# EAGLE design bat-phone Dodo (EAGLE 9.1.0)
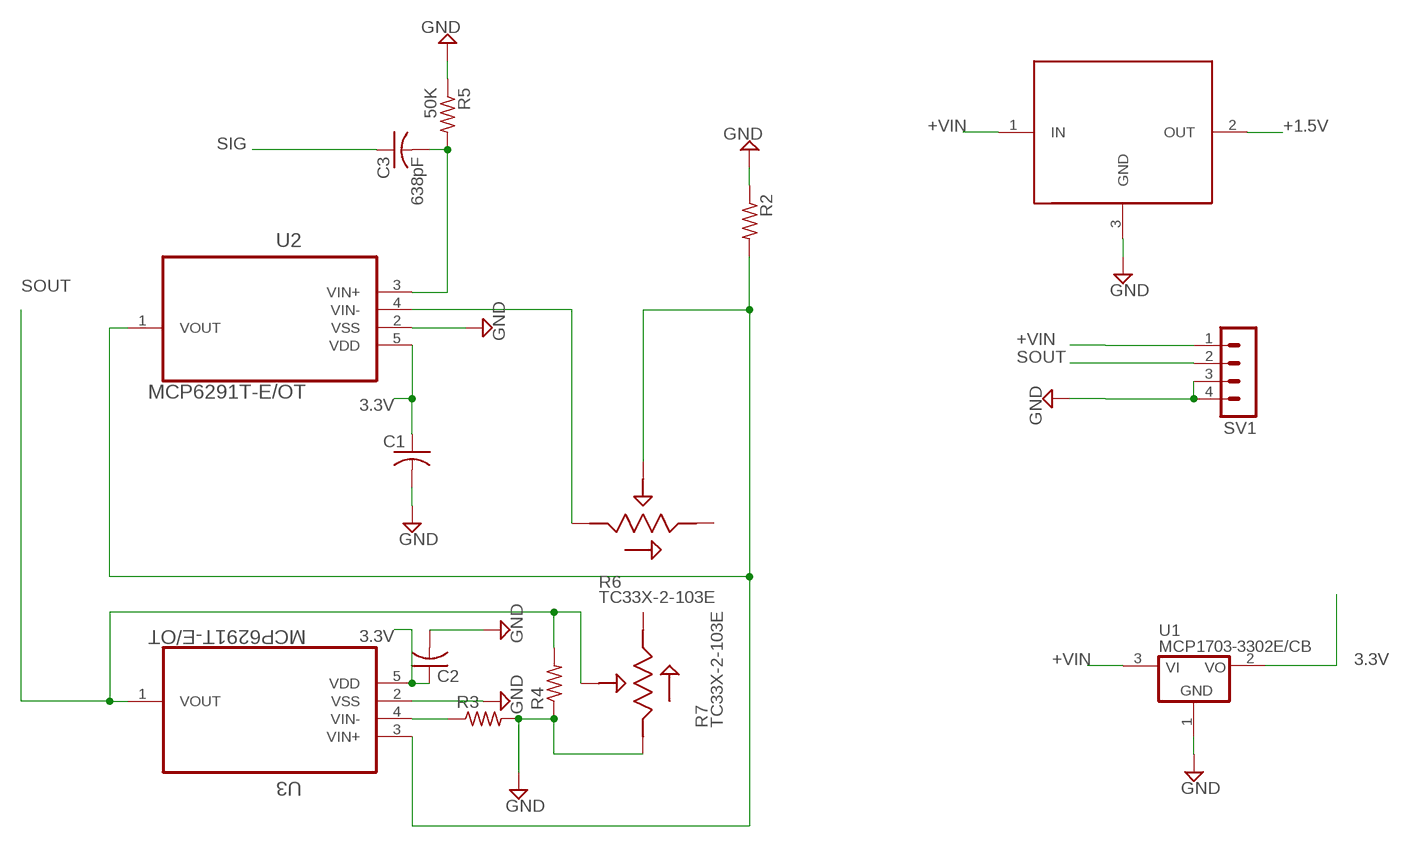
[diagram p0: schematic, sheet 1]

## Parts
C1  C-USC0603K  [C0603K]
C2  C-USC0603K  [C0603K]
C3  638pF  C-USC0603K  [C0603K]
R2  R-US_R0603  [R0603]
R3  R-US_R0603  [R0603]
R4  R-US_R0603  [R0603]
R5  50K  R-US_R0603  [R0603]
R6  TC33X-2-103E  [35WR]
R7  TC33X-2-103E  [35WR]
SV1  MA04-1  [MA04-1]
U1  MCP1703-3302E/CB  [SOT23A_MICROCHIP_CB]
U2  MCP6291T-E/OT  [SOT95P320X145-5N]
U3  MCP6291T-E/OT  [SOT95P320X145-5N]
U$1  AP7313  [SOT23-R]

## Nets
3.3V: C1.1 C2.1 U1.2(VO) U2.5(VDD) U3.5(VDD)
+1.5V: U$1.2(OUT)
+VIN: SV1.1 U1.3(VI) U$1.1(IN)
GND: C1.2 C2.2 R2.1 R3.2 R4.1 R5.1 R7.1 SV1.3 SV1.4 U1.1(GND) U2.2(VSS) U3.2(VSS) U$1.3(GND)
N$1: R6.1 U2.4(VIN-)
N$2: R2.2 R6.2 U2.1(VOUT) U3.3(VIN+)
N$3: R3.1 U3.4(VIN-)
N$4: C3.2 R5.2 U2.3(VIN+)
SIG: C3.1
SOUT: R4.2 R7.2 SV1.2 U3.1(VOUT)
Unconnected: R6.3 R7.3

## Library data of the parts
C1-C3 = resistor:C-US: CAPACITOR, American symbol
R2-R5 = resistor:R-US_: RESISTOR, American symbol
R6 R7 = TC33X-2-103E:TC33X-2-103E: http://octopart.com/tc33x-2-103e-bourns-68150; AVAILABILITY: Unavailable; DESCRIPTION: Res Trimmer 10K Ohm 25% 0.1W_1/10W_ 1_Elec_/1_Mech_Turn _3 X 3.8mm_ Foot Print SMD Embossed T/R; MF: Bourns; MP: TC33X-2-103E; PACKAGE: FakePackage u; PRICE: None
SV1 = con-lstb:MA04-1: PIN HEADER; OC_FARNELL: unknown; OC_NEWARK: unknown
U1 = MCP1703:MCP1703*02E/CB: MCP1703[A] Series of Voltage Regulators – SOT23A (Microchip CB) (1.2 … 5.0)V, LDO, 16 V Input, 100/150/200/250 mA, Low Quiescent Current Source: http://ww1.microchip.com/downloads/en/DeviceDoc/22049f.pdf http://ww1.microchip.com/downloads/en/DeviceDoc/25122A.pdf Packages: SOT23, Microchip package identifier "CB" (dimensions and recommended land patterns acc. to Microchip) Technologies: MCP1703[A]T-xx02E/CB T : Tape and Reel xx: Output Voltage * 1000 mV; 12|15|18|25|28|30|33|40|50 0 : Extra Feature Code (fixed) 2 : Output volt. Tol.: ±2% (standard) E : Temperature range (−40…+125)°C CB: Package: SOT23A Author: Dipl.-Ing. FH Rainer Bayer HHN Hochschule Heilbronn, rainer.bayer@hs-heilbronn.de Ingenieurbüro ing-rb, mail@ing-rb.de
U2 U3 = MCP6291T-E_OT:MCP6291T-E/OT: OP AMP, 10MHZ, SINGLE; AVAILABILITY: Good; DESCRIPTION: MCP6291 Series 6 V 10 MHz Rail-to-Rail I/O Operational Amplifier - SOT-23-5; MF: Microchip; MP: MCP6291T-E/OT; PACKAGE: SOT-23 Microchip; PRICE: 0.58 USD
U$1 = ap7313:AP7313

## Net classes
0 default: width 0.305 mm, drill 0.508 mm, clearance 0.254 mm

## Board
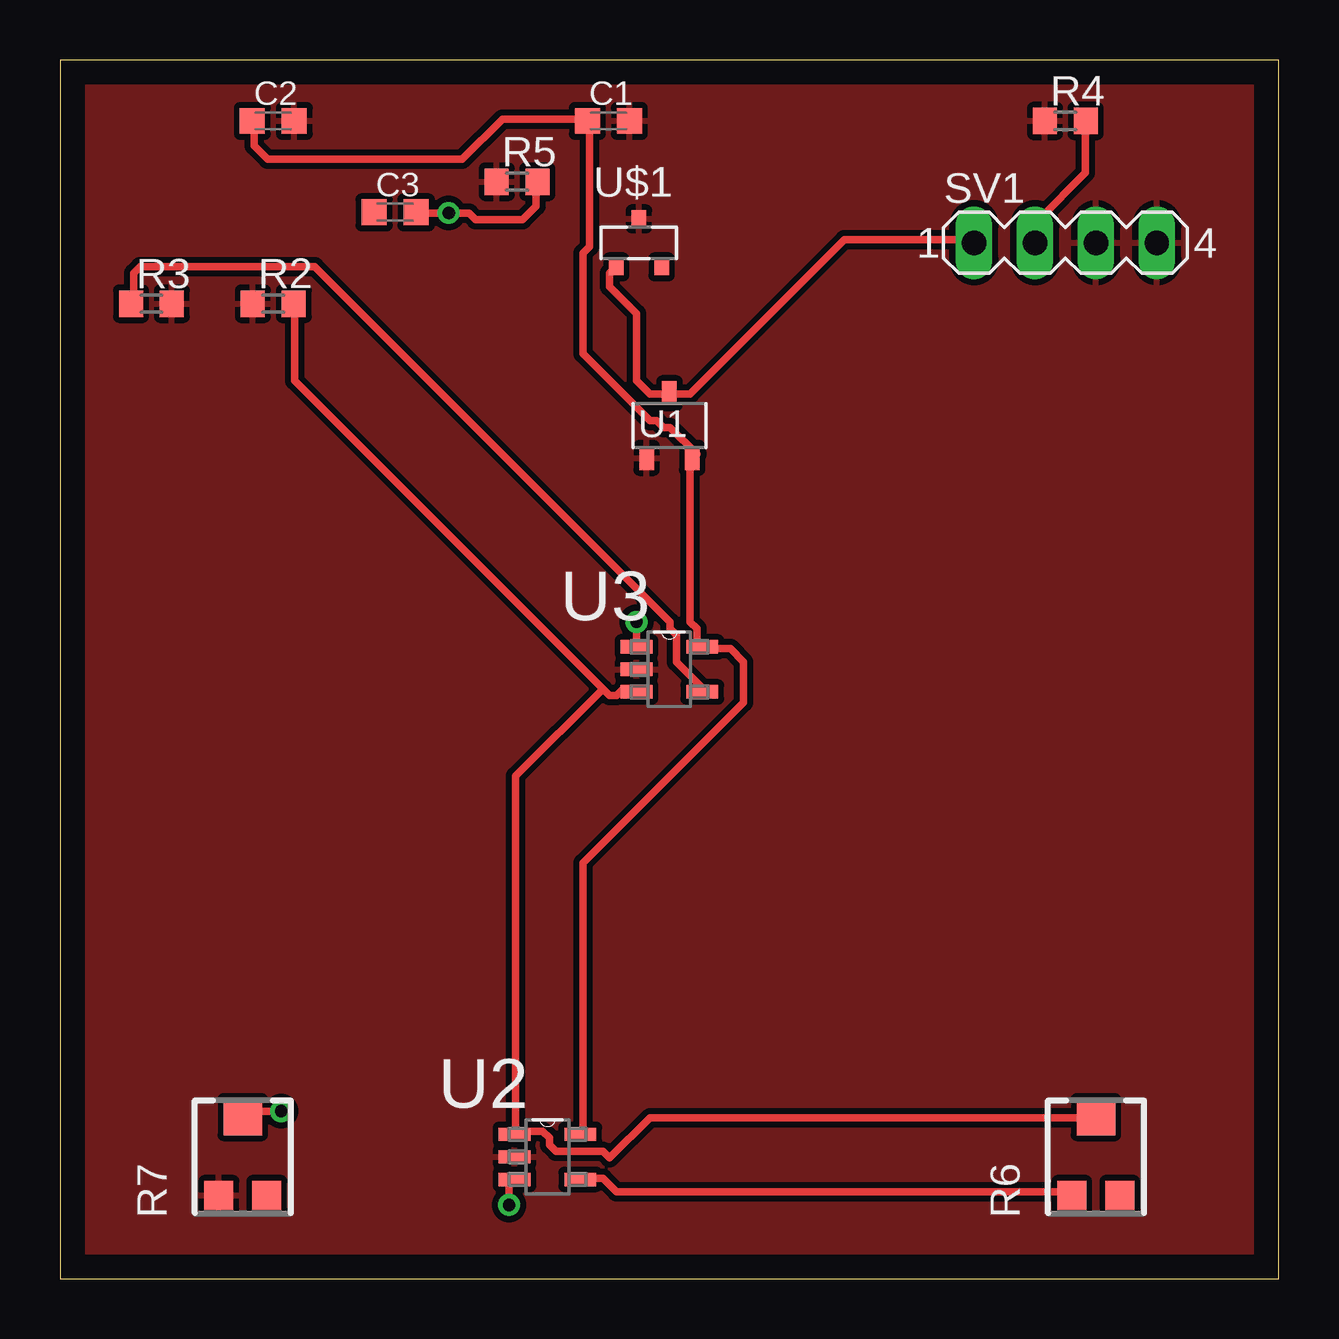
[diagram p1: board, top side]
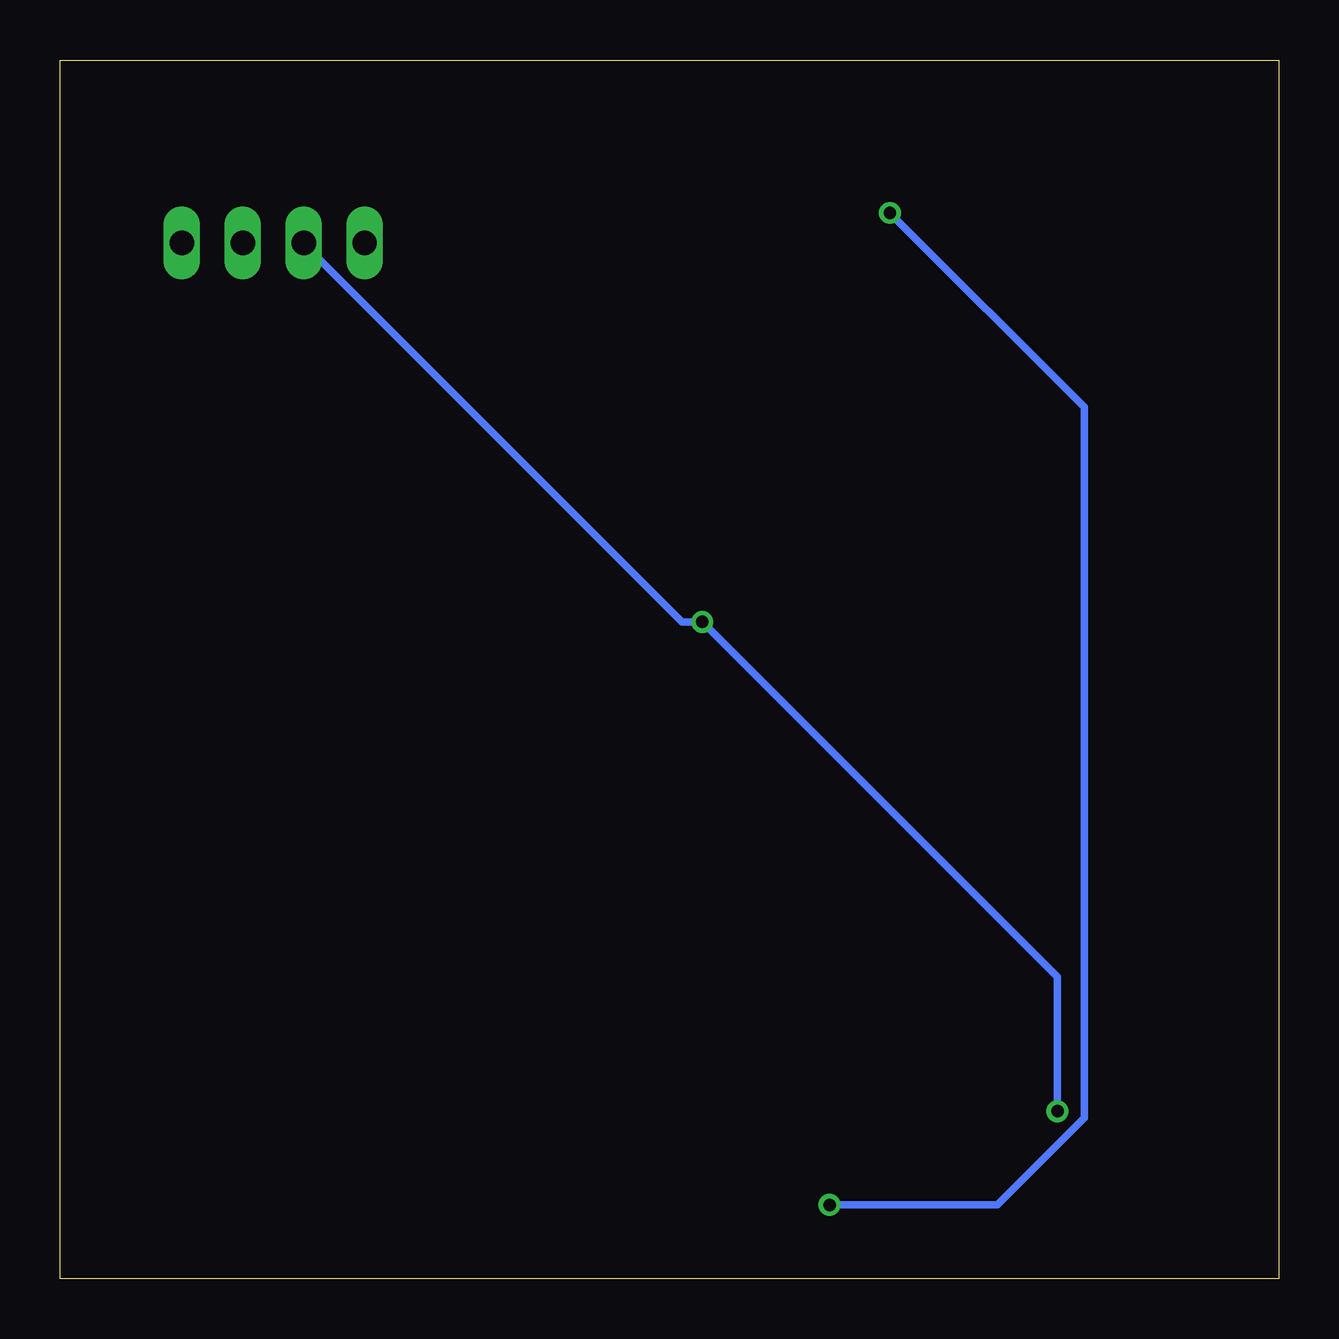
[diagram p2: board, bottom side, seen from below]

Size 50.8 x 50.8 mm. Coordinates in mm from the lower left corner, seen from the top.
Outline: 0,0 50.8,0 50.8,50.8 0,50.8 0,0
Copper layers (1*16): Top 0.035mm / dielectric 1.5mm / Bottom 0.035mm
Design rules "default": minimum track width 6mil, minimum drill 0.35mm, track to track 6mil, track to pad 6mil, pad to pad 6mil, via to via 6mil, smd to smd 6mil, copper to edge 40mil, drill to drill 6mil, minimum pad ring 10mil, minimum via ring 8mil, stop-mask expansion 4mil, vias tented up to drill 0mil, thermal gap 10mil

### Footprints (pad centres in the part's own frame; a part is rotated, then mirrored left to right if it is on the bottom)
C0603K = smd 1.05 x 1.08: 1 -0.875,0; 2 0.875,0
R0603 = smd 1 x 1.1: 1 -0.85,0; 2 0.85,0
35WR = smd 1.2 x 1.2: 1 -1,-1.6; 3 1,-1.6 | smd 1.6 x 1.5: 2 0,1.65
MA04-1 = drill 1.016 long: 1 -3.81,0; 2 -1.27,0; 3 1.27,0; 4 3.81,0
SOT23A_MICROCHIP_CB = smd 0.6 x 1: 1 -0.95,-1.35; 2 0.95,-1.35; 3 0,1.35
SOT95P320X145-5N = smd 1.321 x 0.559: 1 -1.372,0.94; 2 -1.372,0; 3 -1.372,-0.94; 4 1.372,-0.94; 5 1.372,0.94
SOT23-R = smd 0.6 x 0.7: 1 -0.95,-1; 2 0.95,-1; 3 0,1

### Placement (x,y rotation side)
C1  22.86,48.26 0 top
C2  8.89,48.26 0 top
C3  13.97,44.45 0 top
R2  8.89,40.64 0 top
R3  3.81,40.64 0 top
R4  41.91,48.26 0 top
R5  19.05,45.72 0 top
R6  43.18,5.08 0 top
R7  7.62,5.08 0 top
SV1  41.91,43.18 0 top
U1  25.4,35.56 0 top
U2  20.32,5.08 0 top
U3  25.4,25.4 0 top
U$1  24.13,43.18 0 top

### Tracks (layer width: path | path; a pad name or v marks a point on that pad's centre or on a via)
3.3V
  Top 0.305: C2.1 8.1,48.06 8.1,47.22 8.66,46.66 16.76,46.66 18.44,48.34 21.79,48.34 C1.1 22.07,48.06 22.07,43.03 21.79,42.75 21.79,38.56 24.59,35.76 24.87,35.76 25.15,35.48 25.43,35.48 26.54,34.37 U1.2 26.26,34.09 26.26,27.38 26.54,27.1 26.54,26.54 U3.5 26.82,26.26 27.94,26.26 28.5,25.7 28.5,24.03 21.79,17.32 21.79,6.15 U2.5
+VIN
  Top 0.305: U$1.1 22.91,41.91 22.91,41.35 24.03,40.23 24.03,37.44 24.59,36.88 25.15,36.88 U1.3 25.43,36.88 26.26,36.88 32.69,43.31 38,43.31 SV1.1
GND
  pour Top: -1.27,52.07 -1.27,-1.27 52.07,-1.27 52.07,52.07
N$1
  Top 0.305: R6.1 41.91,3.63 23.19,3.63 22.63,4.19 21.79,4.19 U2.4
N$2
  Top 0.305: 22.63,24.59 22.91,24.31 23.19,24.31 23.47,24.59 24.03,24.59 U3.3 | 22.63,24.59 9.78,37.44 9.78,40.51 R2.2 | 22.63,24.59 19,20.95 19,6.15 U2.1 19,5.87 19.28,5.87 19.56,6.15 20.12,6.15 20.4,5.87 20.4,5.59 20.68,5.31 22.63,5.31 22.91,5.03 24.59,6.71 43.03,6.71 R6.2
N$3
  Top 0.305: R3.1 3.07,40.79 3.07,41.91 3.35,42.19 10.62,42.19 25.43,27.38 25.43,27.1 25.7,26.82 25.7,25.7 26.82,24.59 U3.4
N$4  (via drill 0.51)
  Top 0.305: C3.2 15.09,44.42 v16.2,44.42 17.04,44.42 17.32,44.15 19.28,44.15 19.84,44.7 19.84,45.54 R5.2 | v18.72,3.07 18.72,3.91 U2.3
  Bottom 0.305: v18.72,3.07 11.73,3.07 8.1,6.71 8.1,36.32 v16.2,44.42
SOUT  (via drill 0.51)
  Top 0.305: R4.2 42.75,48.06 42.75,46.1 40.79,44.15 40.79,43.31 SV1.2 | v24.03,27.38 24.03,26.54 U3.1 | v9.22,6.99 7.82,6.99 R7.2
  Bottom 0.305: SV1.2 40.51,43.03 24.87,27.38 v24.03,27.38 9.22,12.57 v9.22,6.99